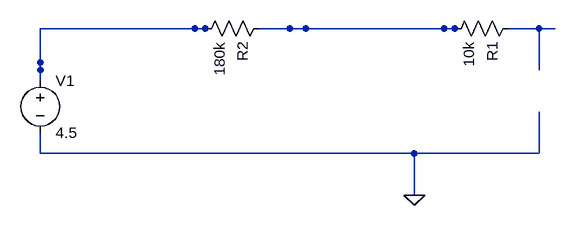
[diagram p0: schematic pannel3.asc]
pannel3.asc, the LTspice schematic file:
Version 4
SHEET 1 880 680
WIRE 912 320 985 320
WIRE 814 320 830 320
SYMBOL res 928 304 R90
SYMATTR InstName R1
SYMATTR Value 10k
WIRE 528 320 601 320
WIRE 430 320 446 320
SYMBOL res 544 304 R90
SYMATTR InstName R2
SYMATTR Value 180k
FLAG 768 576 0
WIRE 192 400 192 372
WIRE 192 512 192 480
SYMBOL voltage 192 384 R0
SYMATTR InstName V1
SYMATTR Value 4.5
WIRE 768 512 832 512
WIRE 704 512 768 512
WIRE 768 512 768 576
WIRE 192 512 256 512
WIRE 960 320 960 384
WIRE 896 512 960 512
WIRE 960 448 960 512
WIRE 192 320 256 320
WIRE 192 320 192 384
WIRE 256 512 320 512
WIRE 640 512 704 512
WIRE 576 512 640 512
WIRE 512 512 576 512
WIRE 448 512 512 512
WIRE 384 512 448 512
WIRE 320 512 384 512
WIRE 320 320 384 320
WIRE 256 320 320 320
WIRE 384 320 448 320
WIRE 576 320 640 320
WIRE 640 320 704 320
WIRE 704 320 768 320
WIRE 768 320 832 320
WIRE 832 512 896 512

The netlist it stands for:
* pannel3.asc
R1 N001 N002 10k
R2 N002 N003 180k
V1 N003 0 4.5
.backanno
.end